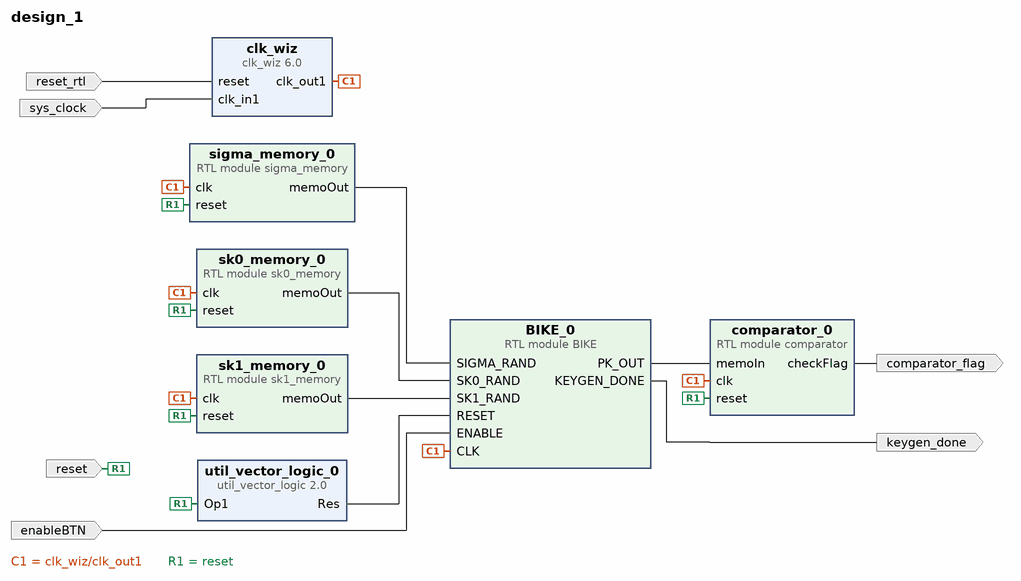
[diagram p0: block diagram of the top level]
# Vivado block design design_1, xc7z020clg400-1, Vivado 2024.2
create_bd_design design_1

create_bd_port -dir I -type clk sys_clock
set_property -dict {CONFIG.FREQ_HZ 125000000 CONFIG.PHASE 0.0} [get_bd_ports sys_clock]
create_bd_port -dir I -type rst reset_rtl
set_property -dict {CONFIG.POLARITY ACTIVE_HIGH} [get_bd_ports reset_rtl]
create_bd_port -dir I reset
create_bd_port -dir O keygen_done
create_bd_port -dir I enableBTN
create_bd_port -dir O comparator_flag

create_bd_cell -type module -reference BIKE BIKE_0
create_bd_cell -type ip -vlnv xilinx.com:ip:clk_wiz:6.0 clk_wiz
set_property -dict [list \
  CONFIG.CLKOUT1_REQUESTED_OUT_FREQ 100.0 \
  CONFIG.CLK_IN1_BOARD_INTERFACE sys_clock \
  CONFIG.USE_BOARD_FLOW true \
] [get_bd_cells clk_wiz]
create_bd_cell -type ip -vlnv xilinx.com:ip:util_vector_logic:2.0 util_vector_logic_0
set_property -dict {CONFIG.C_OPERATION not CONFIG.C_SIZE 1} [get_bd_cells util_vector_logic_0]
create_bd_cell -type module -reference sk0_memory sk0_memory_0
create_bd_cell -type module -reference sk1_memory sk1_memory_0
create_bd_cell -type module -reference sigma_memory sigma_memory_0
create_bd_cell -type module -reference comparator comparator_0

# ---- connections ----

connect_bd_net [get_bd_pins BIKE_0/KEYGEN_DONE] [get_bd_ports keygen_done]
connect_bd_net [get_bd_pins BIKE_0/PK_OUT] [get_bd_pins comparator_0/memoIn]
connect_bd_net [get_bd_pins clk_wiz/clk_out1] \
  [get_bd_pins BIKE_0/CLK] [get_bd_pins sigma_memory_0/clk] [get_bd_pins sk0_memory_0/clk] [get_bd_pins comparator_0/clk] \
  [get_bd_pins sk1_memory_0/clk]
connect_bd_net [get_bd_pins comparator_0/checkFlag] [get_bd_ports comparator_flag]
connect_bd_net [get_bd_ports enableBTN] [get_bd_pins BIKE_0/ENABLE]
connect_bd_net [get_bd_ports reset] \
  [get_bd_pins util_vector_logic_0/Op1] [get_bd_pins sigma_memory_0/reset] [get_bd_pins sk0_memory_0/reset] \
  [get_bd_pins comparator_0/reset] [get_bd_pins sk1_memory_0/reset]
connect_bd_net [get_bd_ports reset_rtl] [get_bd_pins clk_wiz/reset]
connect_bd_net [get_bd_pins sigma_memory_0/memoOut] [get_bd_pins BIKE_0/SIGMA_RAND]
connect_bd_net [get_bd_pins sk0_memory_0/memoOut] [get_bd_pins BIKE_0/SK0_RAND]
connect_bd_net [get_bd_pins sk1_memory_0/memoOut] [get_bd_pins BIKE_0/SK1_RAND]
connect_bd_net [get_bd_ports sys_clock] [get_bd_pins clk_wiz/clk_in1]
connect_bd_net [get_bd_pins util_vector_logic_0/Res] [get_bd_pins BIKE_0/RESET]

validate_bd_design
save_bd_design
